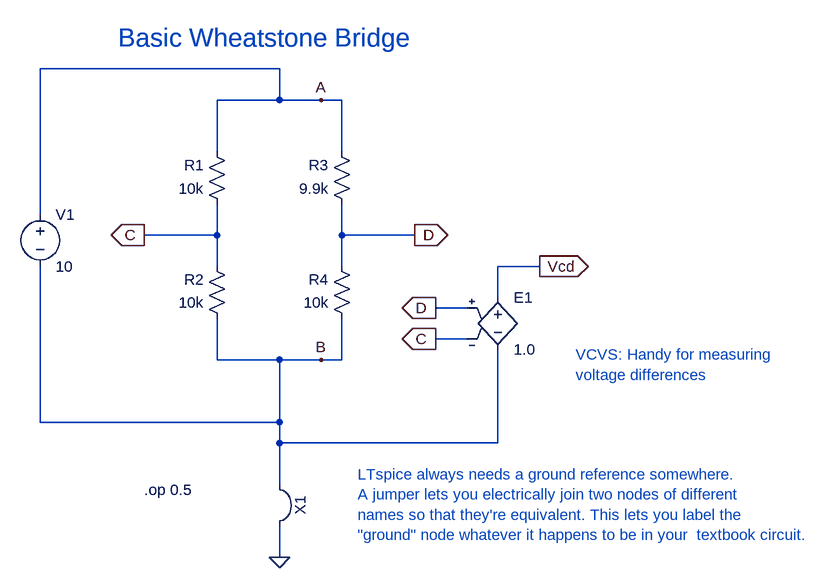
[diagram p0: schematic wheatstone_bridge.asc]
wheatstone_bridge.asc, the LTspice schematic file:
Version 4
SHEET 1 1136 792
WIRE 144 16 -224 16
WIRE 144 64 144 16
WIRE 144 64 48 64
WIRE 208 64 144 64
WIRE 240 64 208 64
WIRE 48 144 48 64
WIRE 240 144 240 64
WIRE -224 240 -224 16
WIRE 48 272 48 224
WIRE 48 272 -64 272
WIRE 240 272 240 224
WIRE 352 272 240 272
WIRE 48 320 48 272
WIRE 240 320 240 272
WIRE 544 320 480 320
WIRE 480 368 480 320
WIRE 432 384 384 384
WIRE 432 432 384 432
WIRE 48 464 48 400
WIRE 144 464 48 464
WIRE 208 464 144 464
WIRE 240 464 240 400
WIRE 240 464 208 464
WIRE -224 560 -224 320
WIRE 144 560 144 464
WIRE 144 560 -224 560
WIRE 144 592 144 560
WIRE 480 592 480 448
WIRE 480 592 144 592
WIRE 144 656 144 592
WIRE 144 768 144 720
FLAG 144 768 0
FLAG -64 272 C
IOPIN -64 272 Out
FLAG 352 272 D
IOPIN 352 272 Out
FLAG 208 64 A
FLAG 208 464 B
FLAG 544 320 Vcd
IOPIN 544 320 Out
FLAG 384 384 D
IOPIN 384 384 Out
FLAG 384 432 C
IOPIN 384 432 Out
SYMBOL res 64 240 R180
WINDOW 0 36 76 Left 2
WINDOW 3 36 40 Left 2
SYMATTR InstName R1
SYMATTR Value 10k
SYMBOL res 64 416 R180
WINDOW 0 36 76 Left 2
WINDOW 3 36 40 Left 2
SYMATTR InstName R2
SYMATTR Value 10k
SYMBOL res 256 240 R180
WINDOW 0 36 76 Left 2
WINDOW 3 36 40 Left 2
SYMATTR InstName R3
SYMATTR Value 9.9k
SYMBOL res 256 416 R180
WINDOW 0 36 76 Left 2
WINDOW 3 36 40 Left 2
SYMATTR InstName R4
SYMATTR Value 10k
SYMBOL Misc\\jumper 208 688 R90
SYMATTR InstName X1
SYMBOL voltage -224 224 R0
WINDOW 123 0 0 Left 0
WINDOW 39 0 0 Left 0
SYMATTR InstName V1
SYMATTR Value 10
SYMBOL e 480 352 R0
SYMATTR InstName E1
SYMATTR Value 1.0
TEXT -64 664 Left 2 !.op 0.5
TEXT -104 -32 Left 4 ;Basic Wheatstone Bridge
TEXT -104 -32 Left 4 ;Basic Wheatstone Bridge
TEXT 264 640 Left 2 ;LTspice always needs a ground reference somewhere.\nA jumper lets you electrically join two nodes of different\nnames so that they're equivalent. This lets you label the\n"ground" node whatever it happens to be in your  textbook circuit.
TEXT 600 456 Left 2 ;VCVS: Handy for measuring\nvoltage differences

The netlist it stands for:
* wheatstone_bridge.asc
R1 C A 10k
R2 0 C 10k
R3 D A 9.9k
R4 0 D 10k
V1 A 0 10
E1 Vcd 0 D C 1.0
.op 0.5
* Basic Wheatstone Bridge
* Basic Wheatstone Bridge
* LTspice always needs a ground reference somewhere.
* A jumper lets you electrically join two nodes of different
* names so that they're equivalent. This lets you label the
* "ground" node whatever it happens to be in your  textbook circuit.
* VCVS: Handy for measuring
* voltage differences
.backanno
.end